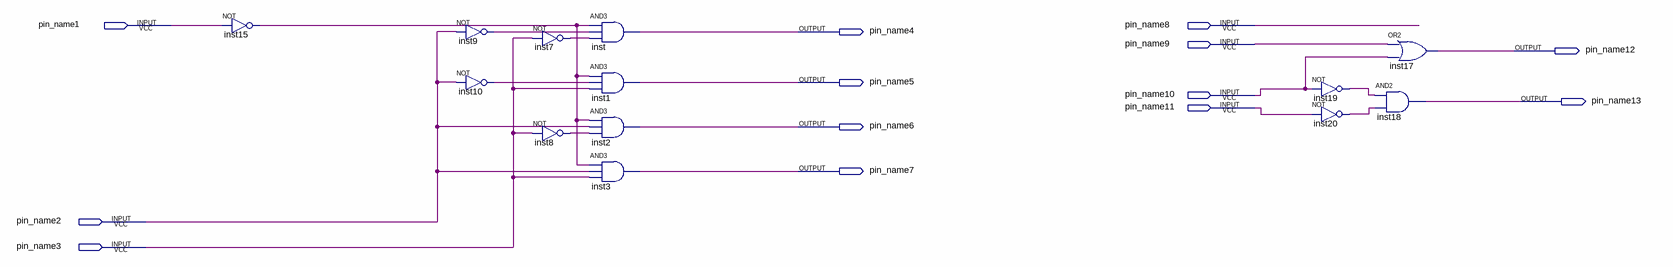
[diagram p0: schematic sheet]
// Quartus schematic lab.bdf as structural Verilog: 13 symbols, 13 pins
module lab (
  input  pin_name1,
  input  pin_name8,
  input  pin_name9,
  input  pin_name10,
  input  pin_name11,
  input  pin_name2,
  input  pin_name3,
  output pin_name4,
  output pin_name12,
  output pin_name5,
  output pin_name13,
  output pin_name6,
  output pin_name7
);

  wire inst7_out, inst8_out, inst9_out, inst10_out, inst15_out, inst19_out, inst20_out;

  not inst15 (inst15_out, pin_name1);
  not inst9 (inst9_out, pin_name2);
  not inst10 (inst10_out, pin_name2);
  not inst7 (inst7_out, pin_name3);
  not inst8 (inst8_out, pin_name3);
  and inst (pin_name4, inst15_out, inst9_out, inst7_out);
  and inst1 (pin_name5, inst15_out, inst10_out, pin_name3);
  and inst2 (pin_name6, inst15_out, pin_name2, inst8_out);
  and inst3 (pin_name7, inst15_out, pin_name2, pin_name3);
  not inst19 (inst19_out, pin_name10);
  not inst20 (inst20_out, pin_name11);
  and inst18 (pin_name13, inst19_out, inst20_out);
  or inst17 (pin_name12, pin_name9, pin_name10);
endmodule
